# Altium project UZ_D_Voltage_3V3_5V.PrjPCB (part 1 of 2)
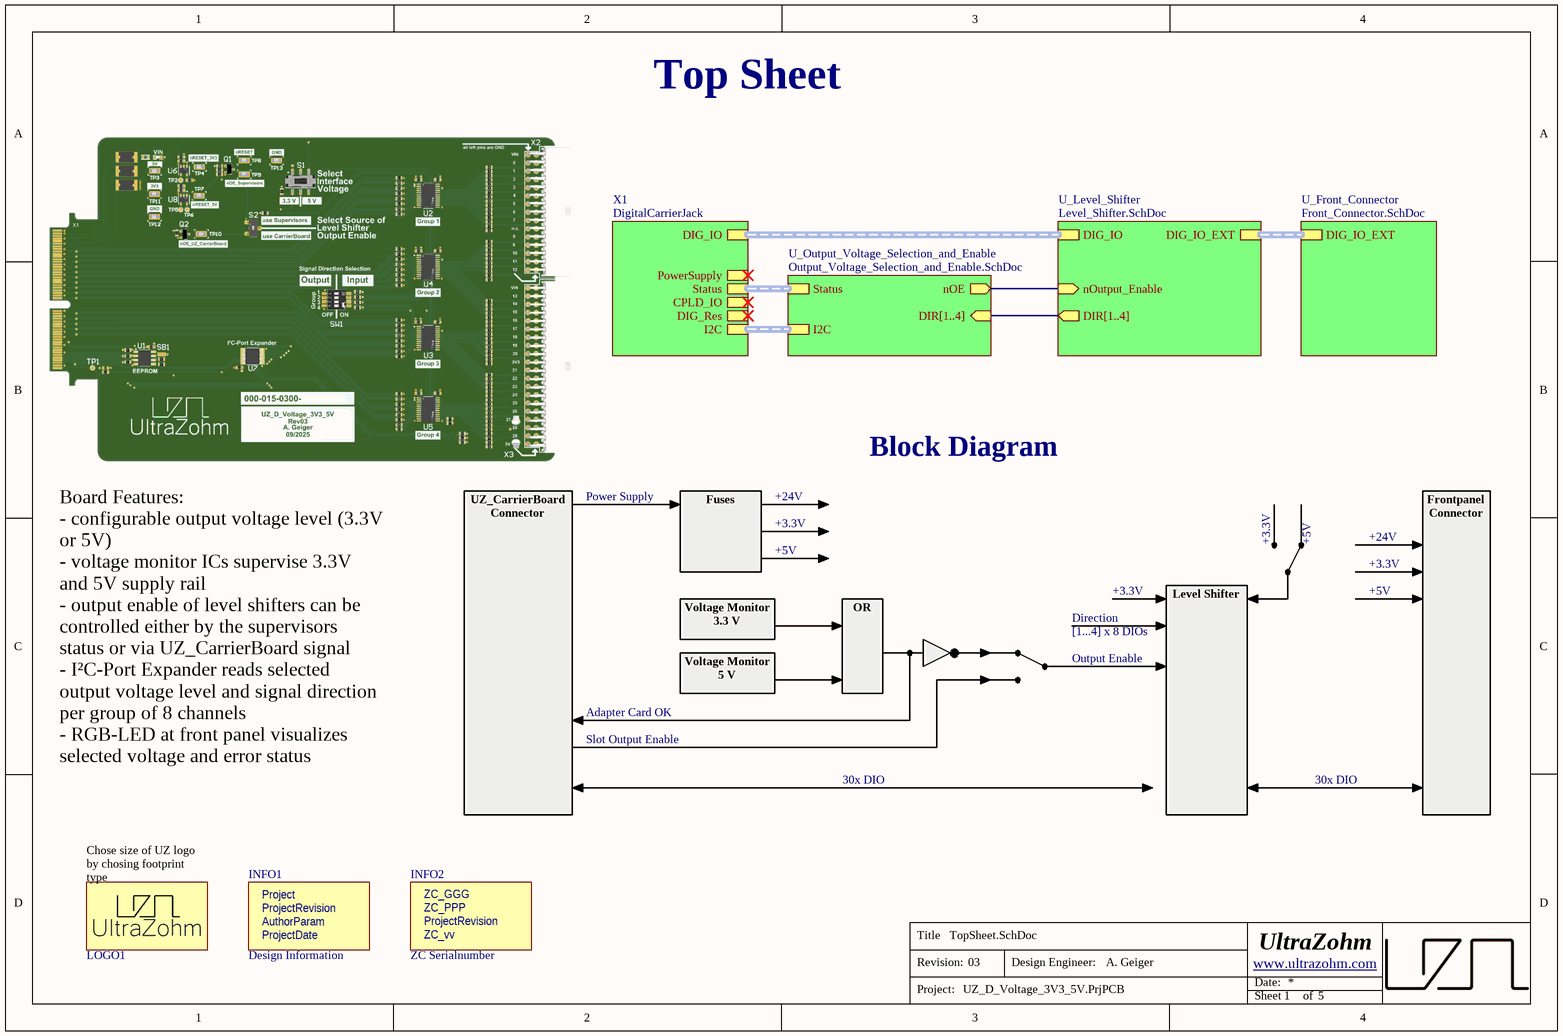
[diagram p0: TopSheet.SchDoc]
Author: A. Geiger; AuthorParam: A. Geiger; Project: UZ_D_Voltage_3V3_5V; ProjectDate: 09/2025; ProjectRevision: 03; ZC_GGG: 000; ZC_PPP: 015
5 sheets, 169 parts. Net scope: hierarchical (ports join the sheet entries above them; power ports are global).
Board file: UZ_D_Voltage_3V3_5V.PcbDoc
Sheets:
  TopSheet.SchDoc
    X1 = DigitalCarrierJack.SchDoc
    U_Front_Connector = Front_Connector.SchDoc
    U_Level_Shifter = Level_Shifter.SchDoc
    U_Output_Voltage_Selection_and_Enable = Output_Voltage_Selection_and_Enable.SchDoc

## Sheet TopSheet.SchDoc
size A4; Author: A. Geiger; CompanyName: Technische Hochschule Nürnberg Georg Simon Ohm; Organization: UltraZohm; Address1: Kesslerplatz 12; Address2: 90489 Nürnberg; Address3: GERMANY; DocumentNumber: 1; SheetNumber: 1; SheetTotal: 5; Website: www.ultrazohm.com

### Parts
INFO1  Design Information  [Design_info]  (no BOM)
INFO2  ZC Serialnumber  [ZC-Serial]  (no BOM)
LOGO1  UZ Logo  [UZ_Logo_small]  (value not drawn)  (no BOM)

### Sub-sheets
U_Front_Connector = Front_Connector.SchDoc: DIG_IO_EXT (harness DigCon_DIG_IO_EXT)
U_Level_Shifter = Level_Shifter.SchDoc: DIG_IO (harness DigCon_DIG_IO), DIG_IO_EXT (harness DigCon_DIG_IO_EXT), nOutput_Enable (in), DIR[1..4] (out)
U_Output_Voltage_Selection_and_Enable = Output_Voltage_Selection_and_Enable.SchDoc: Status (harness DigCon_Status), nOE (out), I2C (harness DigCon_I2C), DIR[1..4] (in)
X1 = DigitalCarrierJack: DIG_IO (harness DigCon_DIG_IO), PowerSupply (harness DigCon_PowerSupply), DIG_Res (harness DigCon_DIG_Res), CPLD_IO (harness DigCon_DCPLD_IO), Status (harness DigCon_Status), I2C (harness DigCon_I2C)

### Nets
nOE: sheet U_Level_Shifter/nOutput_Enable, sheet U_Output_Voltage_Selection_and_Enable/nOE

### Buses and harness runs
bus sheet U_Level_Shifter/DIR[1..4] = sheet U_Output_Voltage_Selection_and_Enable/DIR[1..4]
harness sheet U_Front_Connector/DIG_IO_EXT = sheet U_Level_Shifter/DIG_IO_EXT
harness sheet U_Level_Shifter/DIG_IO = sheet X1/DIG_IO
harness sheet U_Output_Voltage_Selection_and_Enable/I2C = sheet X1/I2C
harness sheet U_Output_Voltage_Selection_and_Enable/Status = sheet X1/Status

### Notes on the sheet
- Top Sheet
- Power Supply
- +24V
- Block Diagram
- Fuses
- +3.3V
- +5V
- Voltage Monitor
  3.3 V
- Direction
- [1...4] x 8 DIOs
- Adapter Card OK
- Voltage Monitor
  5 V
- OR
- Output Enable
- Slot Output Enable
- 30x DIO
- Board Features:
  - configurable output voltage level (3.3V or 5V)
  - voltage monitor ICs supervise 3.3V and 5V supply rail
  - output enable of level shifters can be controlled either by the supervisors status or via UZ_CarrierBoard signal
  - I²C-Port Expander reads selected output voltage level and signal direction per group of 8 channels
  - RGB-LED at front panel visualizes selected voltage and error status
- UZ_CarrierBoard
  Connector
- Level Shifter
- Frontpanel
  Connector
- (near LOGO1) Chose size of UZ logo by chosing footprint type
- Title
- Revision:
- Design Engineer:
- Date:
- Project:
- Sheet
- of
- (in symbol Design_info) Project; ProjectRevision; AuthorParam; ProjectDate
- (in symbol ZC-Serial) ZC_GGG; ZC_PPP; ProjectRevision; ZC_vv

### Library data of the parts
INFO1 = Design_info
INFO2 = ZC-Serial: Manufacturer: UltraZohm; Value: GGG-PPP-VVvv; Created from: FRosner; Manufacturer Part Number: ZC-Serial; PartID: 58; Created On: 15.04.2025 09:17:14; ComponentLink1Description: https://docs.ultrazohm.com/; ComponentLink1URL: homepage; Component Type: ZC Serialnumber; Last Updated: 15.04.2025 09:17:14; Supplier 1: -; Supplier Part Number 1: -; Type: Serial Number; Live Cycle Status: 1
LOGO1 = 1: Official Project Logo of the UltraZohm; Manufacturer: PCB Manufacturer; Manufacturer Part Number: UltraZohm Logo; Created from: T. Wendt; PartID: 1; Created On: 19.02.2021 16:55:56; ComponentLink1Description: Homepage; ComponentLink1URL: https://ultrazohm.com; Component Type: Logo; Last Updated: 02.03.2021 14:31:24; Type: Standard (No BOM); Live Cycle Status: 1

## Sheet DigitalCarrierJack.SchDoc
size A4; Author: A. Geiger; CompanyName: Technische Hochschule Nürnberg Georg Simon Ohm; Organization: UltraZohm; Address1: Kesslerplatz 12; Address2: 90489 Nürnberg; Address3: GERMANY; DocumentNumber: 2; SheetNumber: 2; SheetTotal: 5; Website: www.ultrazohm.com
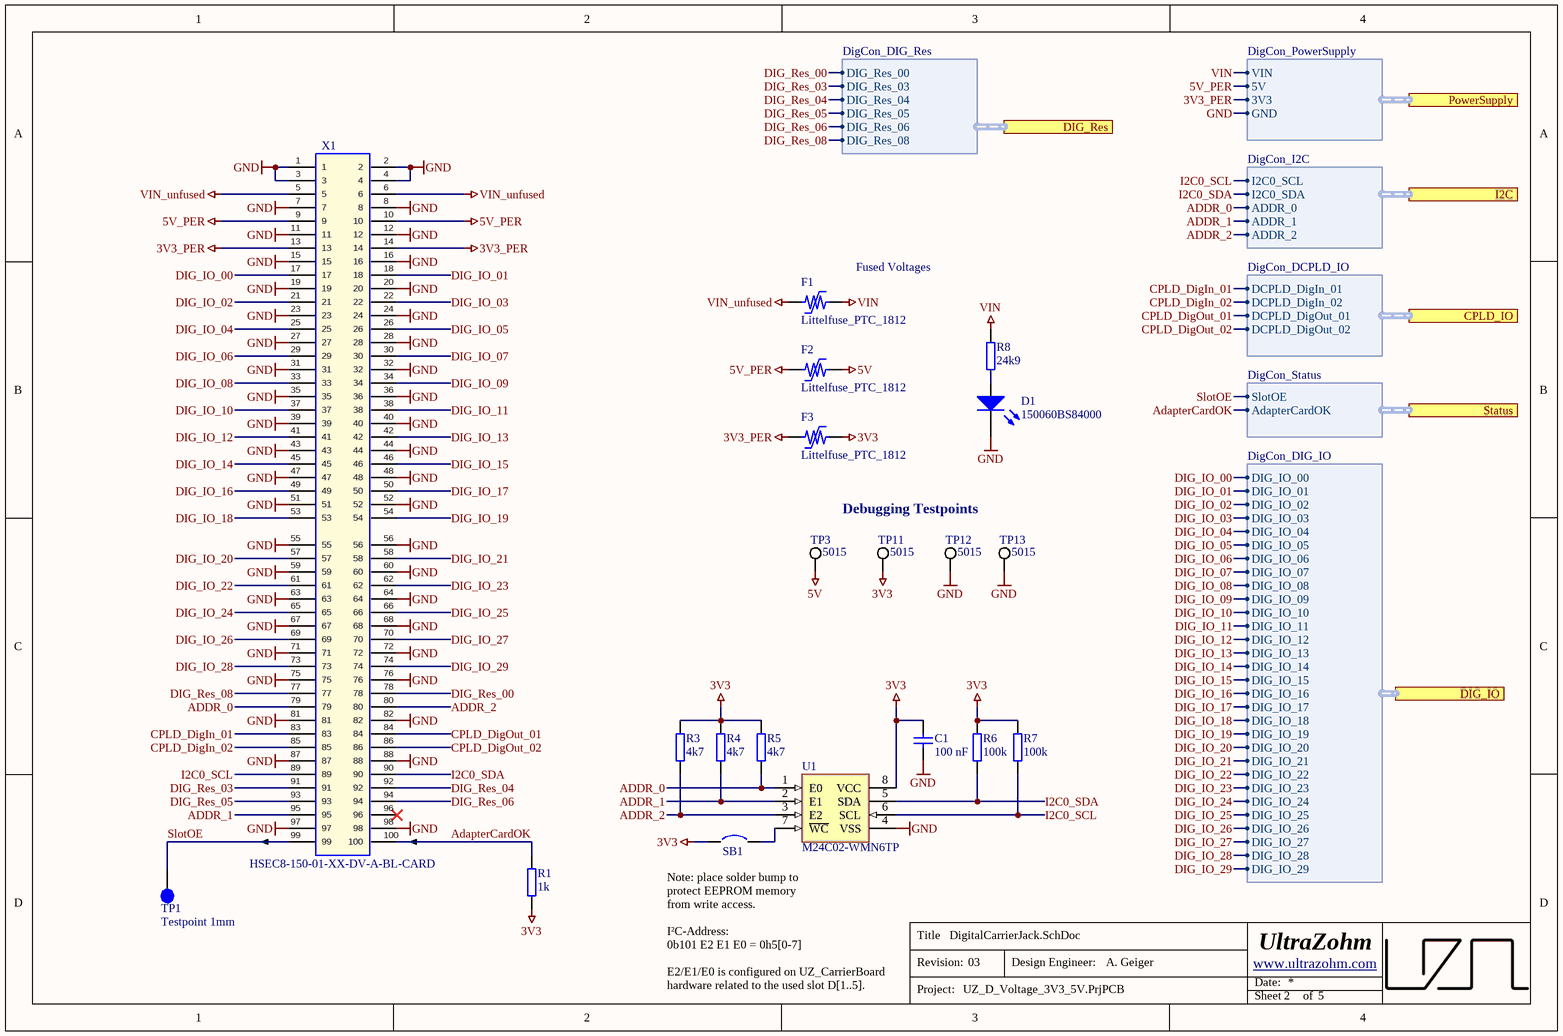
[diagram p1: DigitalCarrierJack.SchDoc]

### Parts
C1  100 nF  [C_0603_TE]
D1  150060BS84000  [WL-SMCW_0603]
F1  Littelfuse_PTC_1812  [1812_PTC_Polyfuse_Littelfuse]
F2  Littelfuse_PTC_1812  [1812_PTC_Polyfuse_Littelfuse]
F3  Littelfuse_PTC_1812  [1812_PTC_Polyfuse_Littelfuse]
R1  1k  [R_0603_TE]
R3  4k7  [R_0603_TE]
R4  4k7  [R_0603_TE]
R5  4k7  [R_0603_TE]
R6  100k  [R_0603_TE]
R7  100k  [R_0603_TE]
R8  24k9  [RES 0603_1608]
SB1  Solder Bump 0603  [SB_0603]  (value not drawn)  (no BOM)
TP1  Testpoint 1mm  [TP_1mm]  (no BOM)
TP3  5015  [FP-5015-MFG]
TP11  5015  [FP-5015-MFG]
TP12  5015  [FP-5015-MFG]
TP13  5015  [FP-5015-MFG]
U1  M24C02-WMN6TP  [D0008A_N]
X1  HSEC8-150-01-XX-DV-A-BL-CARD  [HSEC8-150-01-XX-DV-A-BL-CARD]  (no BOM)

### Ports
CPLD_IO (harness DigCon_DCPLD_IO), DIG_IO (harness DigCon_DIG_IO), DIG_Res (harness DigCon_DIG_Res), I2C (harness DigCon_I2C), PowerSupply (harness DigCon_PowerSupply), Status (harness DigCon_Status)

### Harnesses
DigCon_PowerSupply: GND, 3V3, 5V, VIN
DigCon_I2C: I2C0_SDA, I2C0_SCL, ADDR_0, ADDR_1, ADDR_2
DigCon_Status: SlotOE, AdapterCardOK
DigCon_DCPLD_IO: DCPLD_DigIn_01, DCPLD_DigIn_02, DCPLD_DigOut_01, DCPLD_DigOut_02
DigCon_DIG_IO: DIG_IO_01, DIG_IO_02, DIG_IO_03, DIG_IO_04, DIG_IO_05, DIG_IO_06, DIG_IO_07, DIG_IO_08, DIG_IO_09, DIG_IO_10, DIG_IO_11, DIG_IO_12, DIG_IO_13, DIG_IO_14, DIG_IO_15, DIG_IO_16, DIG_IO_17, DIG_IO_18, DIG_IO_19, DIG_IO_20, DIG_IO_21, DIG_IO_22, DIG_IO_23, DIG_IO_24, DIG_IO_25, DIG_IO_26, DIG_IO_27, DIG_IO_28, DIG_IO_29, DIG_IO_00
DigCon_DIG_Res: DIG_Res_03, DIG_Res_04, DIG_Res_05, DIG_Res_06, DIG_Res_00, DIG_Res_08

### Nets
3V3: C1.1 F3.2 R1.1 R3.1 R4.1 R5.1 R6.1 R7.1 SB1.1 TP11.1 U1.8(VCC)
3V3_PER: F3.1 X1.13 X1.14 ; port PowerSupply.3V3
5V: F2.2 TP3.1
5V_PER: F2.1 X1.9 X1.10 ; port PowerSupply.5V
GND: C1.2 D1.1(K) TP12.1 TP13.1 U1.4(VSS) X1.1 X1.2 X1.3 X1.4 X1.7 X1.8 X1.11 X1.12 X1.15 X1.16 X1.19 X1.20 X1.23 X1.24 X1.27 X1.28 X1.31 X1.32 X1.35 X1.36 X1.39 X1.40 X1.43 X1.44 X1.47 X1.48 X1.51 X1.52 X1.55 X1.56 X1.59 X1.60 X1.63 X1.64 X1.67 X1.68 X1.71 X1.72 X1.75 X1.76 X1.81 X1.82 X1.87 X1.88 X1.97 X1.98 ; port PowerSupply.GND
VIN: F1.2 R8.2 ; port PowerSupply.VIN
VIN_unfused: F1.1 X1.5 X1.6
AdapterCardOK: R1.2 X1.100 ; port Status.AdapterCardOK
ADDR_0: R5.2 U1.1(E0) X1.79 ; port I2C.ADDR_0
ADDR_1: R4.2 U1.2(E1) X1.95 ; port I2C.ADDR_1
ADDR_2: R3.2 U1.3(E2) X1.80 ; port I2C.ADDR_2
CPLD_DigIn_01: X1.83 ; port CPLD_IO.DCPLD_DigIn_01
CPLD_DigIn_02: X1.85 ; port CPLD_IO.DCPLD_DigIn_02
CPLD_DigOut_01: X1.84 ; port CPLD_IO.DCPLD_DigOut_01
CPLD_DigOut_02: X1.86 ; port CPLD_IO.DCPLD_DigOut_02
DIG_IO_00: X1.17 ; port DIG_IO.DIG_IO_00
DIG_IO_01: X1.18 ; port DIG_IO.DIG_IO_01
DIG_IO_02: X1.21 ; port DIG_IO.DIG_IO_02
DIG_IO_03: X1.22 ; port DIG_IO.DIG_IO_03
DIG_IO_04: X1.25 ; port DIG_IO.DIG_IO_04
DIG_IO_05: X1.26 ; port DIG_IO.DIG_IO_05
DIG_IO_06: X1.29 ; port DIG_IO.DIG_IO_06
DIG_IO_07: X1.30 ; port DIG_IO.DIG_IO_07
DIG_IO_08: X1.33 ; port DIG_IO.DIG_IO_08
DIG_IO_09: X1.34 ; port DIG_IO.DIG_IO_09
DIG_IO_10: X1.37 ; port DIG_IO.DIG_IO_10
DIG_IO_11: X1.38 ; port DIG_IO.DIG_IO_11
DIG_IO_12: X1.41 ; port DIG_IO.DIG_IO_12
DIG_IO_13: X1.42 ; port DIG_IO.DIG_IO_13
DIG_IO_14: X1.45 ; port DIG_IO.DIG_IO_14
DIG_IO_15: X1.46 ; port DIG_IO.DIG_IO_15
DIG_IO_16: X1.49 ; port DIG_IO.DIG_IO_16
DIG_IO_17: X1.50 ; port DIG_IO.DIG_IO_17
DIG_IO_18: X1.53 ; port DIG_IO.DIG_IO_18
DIG_IO_19: X1.54 ; port DIG_IO.DIG_IO_19
DIG_IO_20: X1.57 ; port DIG_IO.DIG_IO_20
DIG_IO_21: X1.58 ; port DIG_IO.DIG_IO_21
DIG_IO_22: X1.61 ; port DIG_IO.DIG_IO_22
DIG_IO_23: X1.62 ; port DIG_IO.DIG_IO_23
DIG_IO_24: X1.65 ; port DIG_IO.DIG_IO_24
DIG_IO_25: X1.66 ; port DIG_IO.DIG_IO_25
DIG_IO_26: X1.69 ; port DIG_IO.DIG_IO_26
DIG_IO_27: X1.70 ; port DIG_IO.DIG_IO_27
DIG_IO_28: X1.73 ; port DIG_IO.DIG_IO_28
DIG_IO_29: X1.74 ; port DIG_IO.DIG_IO_29
DIG_Res_00: X1.78 ; port DIG_Res.DIG_Res_00
DIG_Res_03: X1.91 ; port DIG_Res.DIG_Res_03
DIG_Res_04: X1.92 ; port DIG_Res.DIG_Res_04
DIG_Res_05: X1.93 ; port DIG_Res.DIG_Res_05
DIG_Res_06: X1.94 ; port DIG_Res.DIG_Res_06
DIG_Res_08: X1.77 ; port DIG_Res.DIG_Res_08
I2C0_SCL: R7.2 U1.6(SCL) X1.89 ; port I2C.I2C0_SCL
I2C0_SDA: R6.2 U1.5(SDA) X1.90 ; port I2C.I2C0_SDA
SlotOE: TP1.1 X1.99 ; port Status.SlotOE
NetD1_2: D1.2(A) R8.1
NetSB1_2: SB1.2 U1.7(~{WC})

Not connected (* = marked no-connect by the designer): X1 96*

### Notes on the sheet
- (near F1) Fused Voltages
- Debugging Testpoints
- Note: place solder bump to protect EEPROM memory from write access.
- I²C-Address:
  0b101 E2 E1 E0 = 0h5[0-7]
  E2/E1/E0 is configured on UZ_CarrierBoard hardware related to the used slot D[1..5].
- Title
- Revision:
- Design Engineer:
- Date:
- Project:
- Sheet
- of

### Library data of the parts
C1 = UZgen_C_0603_100nF_50V_X7R: Generic capacitor; Manufacturer: UZgen; Tolerance: 10 %; Created from: AGeiger; Voltage: 50V; Manufacturer Part Number: UZgen_C_0603_100nF_50V_X7R; PartID: 1; Created On: 02.07.2024 14:42:23; Device Package: 0603; Last Updated: 08.08.2024 15:01:15; Mounting Type: SMD; Value: 100 nF; Technology: X7R
D1 = 150060BS84000: WL-SMCW SMD Mono-color Chip LED Waterclear Blue; Manufacturer: Wuerth Elektronik; Type: Standard; Created from: MGremer; Forward Current I_f: 20 mA; Forward Voltage U_f: 3.2 V; Wavelength: 470 nm; Light Intensity: 560 mcd; Nominal Power: 78 mW; Manufacturer Part Number: 150060BS84000; PartID: 1; Created On: 08.12.2020 10:19:38; ComponentLink1Description: Datasheet; ComponentLink1URL: https://www.mouser.de/datasheet/2/445/150060BS84000-1838909.pdf; Component Type: LED Diode; Device Package: 0603; Last Updated: 21.02.2024 14:46:49; Mounting Type: SMD; Operating Temperature: -40 - 85 °C; Supplier 1: Mouser; Supplier Part Number 1: 710-150060BS84000; Supplier 2: Farnell; Supplier Part Number 2: 3408611; Supplier 3: Digi-Key; Supplier Part Number 3: 732-150060BS84000CT-ND; Live Cycle Status: 1; Stock number: not stored; Color: blue; LCSC Part Number: C5197644
F1-F3 = Littelfuse_PTC_1812: POLYSWITCH RESETTABLE DEVICES; MPN: miniASMDC110F/24; Value: PTC, 1.1 A, 24V; Voltage: 24V; Trip Current: 2.2A; Hold Current: 1.1A; Resistance: 0.18 Ohm; Type: Fuse; Nominal current: 1 A; Created from: MHlatky; MF: Littelfuse; Created: 2019_02_10_AGeiger; Package: 1812; ComponentLink1URL: https://www.littelfuse.com/~/media/electronics/datasheets/resettable_ptcs/littelfuse_ptc_surface_mount_catalog_datasheet.pdf.pdf; ComponentLink1Description: Datasheet; Manufacturer Part Number: Littelfuse_PTC_1812; PartID: 5; Created On: 07.05.2021 06:50:33; Component Type: Littelfuse_PTC_1812; Last Updated: 27.05.2022 15:06:17; Manufacturer: Littelfuse; Mounting Type: SMD; Operating Temperature: -40 - 85 °C; Supplier 1: Mouser; Supplier Part Number 1: 530-0ZCG0150BF2C; Live Cycle Status: 1; LCSC Part Number: C70119
R1 = UZgen_R_0603_1k: Generic resistor; Manufacturer: UZgen; Tolerance: 1 %; Created from: UZgenTool; Manufacturer Part Number: UZgen_R_0603_1k; PartID: 221; Created On: 02.07.2024 17:29:49; Value: 1k; Device Package: 0603; Mounting Type: SMD; Last Updated: 02.07.2024 17:29:49
R3-R5 = UZgen_R_0603_4k7: Generic resistor; Manufacturer: UZgen; Tolerance: 1 %; Created from: UZgenTool; Manufacturer Part Number: UZgen_R_0603_4k7; PartID: 237; Created On: 02.07.2024 17:29:50; Device Package: 0603; Last Updated: 02.07.2024 17:29:50; Mounting Type: SMD; Value: 4k7
R6 R7 = UZgen_R_0603_100k: Generic resistor; Manufacturer: UZgen; Tolerance: 1 %; Created from: UZgenTool; Manufacturer Part Number: UZgen_R_0603_100k; PartID: 268; Created On: 02.07.2024 17:29:50; Device Package: 0603; Last Updated: 02.07.2024 17:29:50; Mounting Type: SMD; Value: 100k
R8 = CRCW060324K9FKEA: SMD resistor 1%; Manufacturer: Vishay; Created from: MGremer; Manufacturer Part Number: CRCW060324K9FKEA; PartID: 157; Created On: 14.12.2020 16:17:14; ComponentLink1Description: Datasheet; ComponentLink1URL: https://www.mouser.de/datasheet/2/427/dcrcwe3-1762152.pdf; Component Type: SMD resistor; Device Package: 0603; Last Updated: 28.03.2025 21:19:13; Mounting Type: SMD; Supplier 1: Mouser; Supplier Part Number 1: 71-CRCW0603-24.9K-E3; Type: Resistor; Tolerance: 1%; Value: 24k9; Live Cycle Status: 1; Stock number: not stored; LCSC Part Number: C844763
SB1 = =Value: Created from: AGeiger; Revision: July-2002: Re-released for DXP Platform.; PartID: 1; Created On: 09.01.2024 17:13:56; Component Type: Solder Bump; Device Package: 0603; Last Updated: 09.01.2024 17:13:56; Manufacturer Part Number: Solder Bump 0603; Mounting Type: SMD; Value: Solder Bump 0603
TP1 = NULL: Manufacturer Part Number: NULL; Created from: AGeiger; Created: 2018_06_25_AGeiger; Value: Testpoint 1mm; PartID: 9; Created On: 20.09.2022 13:14:57; Component Type: Testpoint; Last Updated: 20.09.2022 13:15:39; Manufacturer: NULL; Supplier 1: NULL; Supplier Part Number 1: NULL; Type: Testpoint; Live Cycle Status: 1
TP3 TP11-TP13 = 5015: Circuit Board Hardware - PCB SM TEST POINT ON T&R - MINIATURE; Manufacturer: Keystone Electronics; Value: SMD Testpoint; Created from: AGeiger; ComponentLink1Description: Datasheet; ComponentLink2URL: http://www.keyelco.com/product-pdf.cfm?p=1357; ComponentLink1URL: https://www.mouser.de/datasheet/2/215/015-744075.pdf; ComponentLink2Description: Datasheet; Manufacturer Part Number: 5015; PartID: 26; Created On: 03.06.2023 11:19:55; Component Type: Circuit Board Hardware; Device Package: SMD; Last Updated: 03.06.2023 11:43:17; Mounting Type: SMD; Supplier 1: Mouser; Supplier Part Number 1: 534-5015; Type: PCB SMD Testpoint; Live Cycle Status: 1; LCSC Part Number: C5199798
U1 = M24C02-WMN6TP: 2Kbit I2C SOP-8 EEPROM ROHS; Manufacturer: STMicroelectronics; Created from: AGeiger; Manufacturer Part Number: M24C02-WMN6TP; PartID: 1; Created On: 19.11.2023 14:54:27; ComponentLink1Description: Datasheet; ComponentLink1URL: https://www.st.com/resource/en/datasheet/m24c01-w.pdf; Component Type: EEPROM; Device Package: SOIC-8; Last Updated: 19.11.2023 21:39:04; Mounting Type: SMD; Operating Temperature: -40 to +85 °C; Series: M24xxx; Supplier 1: Mouser; Supplier Part Number 1: 511-M24C02-WMN6TP; Supplier 2: LCSC; Supplier Part Number 2: C7562; Type: Memory; Value: M24C02-WMN6TP; LCSC Part Number: C7562
X1 = HSEC8-150-01-XX-DV-A-BL-CARD: Mating Card Layout for HSEC8-150-01-XX-DV-A-BL; Manufacturer: SAMTEC; Created: 2018_04_23_AGeiger; Value: HSEC8-150-01-XX-DV-A-BL-CARD

## Sheet Front_Connector.SchDoc
size A4; Author: A. Geiger; CompanyName: Technische Hochschule Nürnberg Georg Simon Ohm; Organization: UltraZohm; Address1: Kesslerplatz 12; Address2: 90489 Nürnberg; Address3: GERMANY; DocumentNumber: 3; SheetNumber: 3; SheetTotal: 5; Website: www.ultrazohm.com
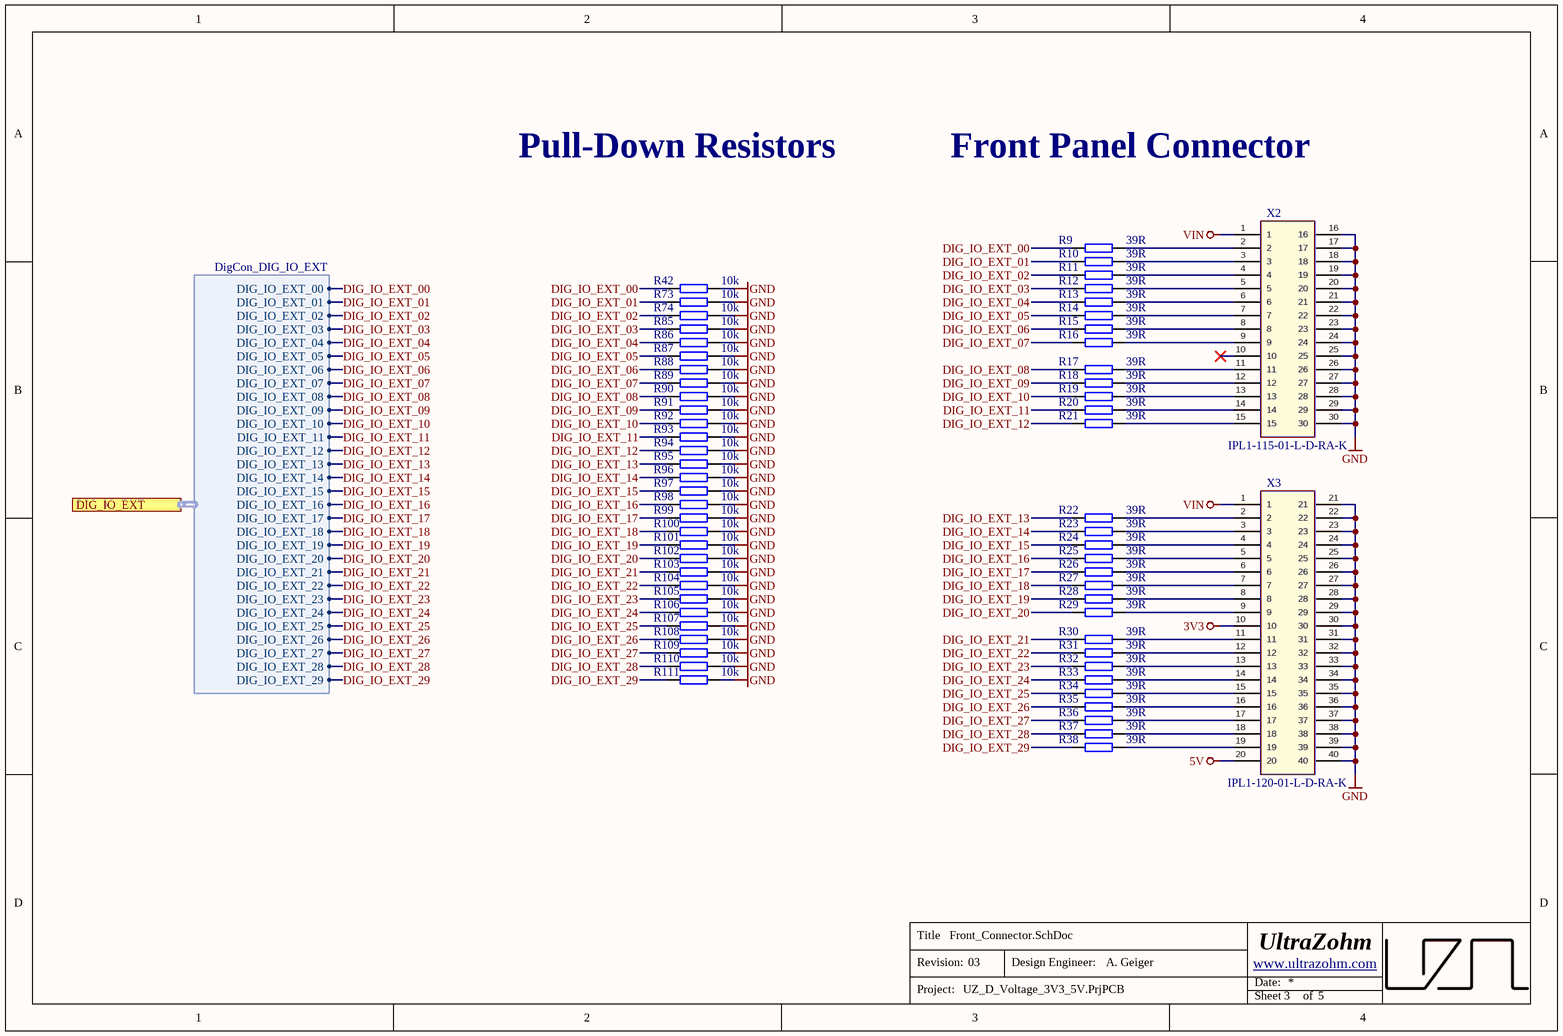
[diagram p2: Front_Connector.SchDoc]

### Parts
R9  39R  [R_0603_TE]
R10  39R  [R_0603_TE]
R11  39R  [R_0603_TE]
R12  39R  [R_0603_TE]
R13  39R  [R_0603_TE]
R14  39R  [R_0603_TE]
R15  39R  [R_0603_TE]
R16  39R  [R_0603_TE]
R17  39R  [R_0603_TE]
R18  39R  [R_0603_TE]
R19  39R  [R_0603_TE]
R20  39R  [R_0603_TE]
R21  39R  [R_0603_TE]
R22  39R  [R_0603_TE]
R23  39R  [R_0603_TE]
R24  39R  [R_0603_TE]
R25  39R  [R_0603_TE]
R26  39R  [R_0603_TE]
R27  39R  [R_0603_TE]
R28  39R  [R_0603_TE]
R29  39R  [R_0603_TE]
R30  39R  [R_0603_TE]
R31  39R  [R_0603_TE]
R32  39R  [R_0603_TE]
R33  39R  [R_0603_TE]
R34  39R  [R_0603_TE]
R35  39R  [R_0603_TE]
R36  39R  [R_0603_TE]
R37  39R  [R_0603_TE]
R38  39R  [R_0603_TE]
R42  10k  [R_0603_TE]
R73  10k  [R_0603_TE]
R74  10k  [R_0603_TE]
R85  10k  [R_0603_TE]
R86  10k  [R_0603_TE]
R87  10k  [R_0603_TE]
R88  10k  [R_0603_TE]
R89  10k  [R_0603_TE]
R90  10k  [R_0603_TE]
R91  10k  [R_0603_TE]
R92  10k  [R_0603_TE]
R93  10k  [R_0603_TE]
R94  10k  [R_0603_TE]
R95  10k  [R_0603_TE]
R96  10k  [R_0603_TE]
R97  10k  [R_0603_TE]
R98  10k  [R_0603_TE]
R99  10k  [R_0603_TE]
R100  10k  [R_0603_TE]
R101  10k  [R_0603_TE]
R102  10k  [R_0603_TE]
R103  10k  [R_0603_TE]
R104  10k  [R_0603_TE]
R105  10k  [R_0603_TE]
R106  10k  [R_0603_TE]
R107  10k  [R_0603_TE]
R108  10k  [R_0603_TE]
R109  10k  [R_0603_TE]
R110  10k  [R_0603_TE]
R111  10k  [R_0603_TE]
X2  IPL1-115-01-L-D-RA-K  [IPL1-115-01-XX-D-RA]
X3  IPL1-120-01-L-D-RA-K  [IPL1-120-01-XX-D-RA]

### Ports
DIG_IO_EXT (harness DigCon_DIG_IO_EXT)

### Harnesses
DigCon_DIG_IO_EXT: DIG_IO_EXT_00, DIG_IO_EXT_01, DIG_IO_EXT_02, DIG_IO_EXT_03, DIG_IO_EXT_04, DIG_IO_EXT_05, DIG_IO_EXT_06, DIG_IO_EXT_07, DIG_IO_EXT_08, DIG_IO_EXT_09, DIG_IO_EXT_10, DIG_IO_EXT_11, DIG_IO_EXT_12, DIG_IO_EXT_13, DIG_IO_EXT_14, DIG_IO_EXT_15, DIG_IO_EXT_16, DIG_IO_EXT_17, DIG_IO_EXT_18, DIG_IO_EXT_19, DIG_IO_EXT_20, DIG_IO_EXT_21, DIG_IO_EXT_22, DIG_IO_EXT_23, DIG_IO_EXT_24, DIG_IO_EXT_25, DIG_IO_EXT_26, DIG_IO_EXT_27, DIG_IO_EXT_28, DIG_IO_EXT_29

### Nets
3V3: X3.10
5V: X3.20
GND: R42.2 R73.2 R74.2 R85.2 R86.2 R87.2 R88.2 R89.2 R90.2 R91.2 R92.2 R93.2 R94.2 R95.2 R96.2 R97.2 R98.2 R99.2 R100.2 R101.2 R102.2 R103.2 R104.2 R105.2 R106.2 R107.2 R108.2 R109.2 R110.2 R111.2 X2.16 X2.17 X2.18 X2.19 X2.20 X2.21 X2.22 X2.23 X2.24 X2.25 X2.26 X2.27 X2.28 X2.29 X2.30 X3.21 X3.22 X3.23 X3.24 X3.25 X3.26 X3.27 X3.28 X3.29 X3.30 X3.31 X3.32 X3.33 X3.34 X3.35 X3.36 X3.37 X3.38 X3.39 X3.40
VIN: X2.1 X3.1
DIG_IO_EXT_00: R9.1 R42.1 ; port DIG_IO_EXT.DIG_IO_EXT_00
DIG_IO_EXT_01: R10.1 R73.1 ; port DIG_IO_EXT.DIG_IO_EXT_01
DIG_IO_EXT_02: R11.1 R74.1 ; port DIG_IO_EXT.DIG_IO_EXT_02
DIG_IO_EXT_03: R12.1 R85.1 ; port DIG_IO_EXT.DIG_IO_EXT_03
DIG_IO_EXT_04: R13.1 R86.1 ; port DIG_IO_EXT.DIG_IO_EXT_04
DIG_IO_EXT_05: R14.1 R87.1 ; port DIG_IO_EXT.DIG_IO_EXT_05
DIG_IO_EXT_06: R15.1 R88.1 ; port DIG_IO_EXT.DIG_IO_EXT_06
DIG_IO_EXT_07: R16.1 R89.1 ; port DIG_IO_EXT.DIG_IO_EXT_07
DIG_IO_EXT_08: R17.1 R90.1 ; port DIG_IO_EXT.DIG_IO_EXT_08
DIG_IO_EXT_09: R18.1 R91.1 ; port DIG_IO_EXT.DIG_IO_EXT_09
DIG_IO_EXT_10: R19.1 R92.1 ; port DIG_IO_EXT.DIG_IO_EXT_10
DIG_IO_EXT_11: R20.1 R93.1 ; port DIG_IO_EXT.DIG_IO_EXT_11
DIG_IO_EXT_12: R21.1 R94.1 ; port DIG_IO_EXT.DIG_IO_EXT_12
DIG_IO_EXT_13: R22.1 R95.1 ; port DIG_IO_EXT.DIG_IO_EXT_13
DIG_IO_EXT_14: R23.1 R96.1 ; port DIG_IO_EXT.DIG_IO_EXT_14
DIG_IO_EXT_15: R24.1 R97.1 ; port DIG_IO_EXT.DIG_IO_EXT_15
DIG_IO_EXT_16: R25.1 R98.1 ; port DIG_IO_EXT.DIG_IO_EXT_16
DIG_IO_EXT_17: R26.1 R99.1 ; port DIG_IO_EXT.DIG_IO_EXT_17
DIG_IO_EXT_18: R27.1 R100.1 ; port DIG_IO_EXT.DIG_IO_EXT_18
DIG_IO_EXT_19: R28.1 R101.1 ; port DIG_IO_EXT.DIG_IO_EXT_19
DIG_IO_EXT_20: R29.1 R102.1 ; port DIG_IO_EXT.DIG_IO_EXT_20
DIG_IO_EXT_21: R30.1 R103.1 ; port DIG_IO_EXT.DIG_IO_EXT_21
DIG_IO_EXT_22: R31.1 R104.1 ; port DIG_IO_EXT.DIG_IO_EXT_22
DIG_IO_EXT_23: R32.1 R105.1 ; port DIG_IO_EXT.DIG_IO_EXT_23
DIG_IO_EXT_24: R33.1 R106.1 ; port DIG_IO_EXT.DIG_IO_EXT_24
DIG_IO_EXT_25: R34.1 R107.1 ; port DIG_IO_EXT.DIG_IO_EXT_25
DIG_IO_EXT_26: R35.1 R108.1 ; port DIG_IO_EXT.DIG_IO_EXT_26
DIG_IO_EXT_27: R36.1 R109.1 ; port DIG_IO_EXT.DIG_IO_EXT_27
DIG_IO_EXT_28: R37.1 R110.1 ; port DIG_IO_EXT.DIG_IO_EXT_28
DIG_IO_EXT_29: R38.1 R111.1 ; port DIG_IO_EXT.DIG_IO_EXT_29
NetR9_2: R9.2 X2.2
NetR10_2: R10.2 X2.3
NetR11_2: R11.2 X2.4
NetR12_2: R12.2 X2.5
NetR13_2: R13.2 X2.6
NetR14_2: R14.2 X2.7
NetR15_2: R15.2 X2.8
NetR16_2: R16.2 X2.9
NetR17_2: R17.2 X2.11
NetR18_2: R18.2 X2.12
NetR19_2: R19.2 X2.13
NetR20_2: R20.2 X2.14
NetR21_2: R21.2 X2.15
NetR22_2: R22.2 X3.2
NetR23_2: R23.2 X3.3
NetR24_2: R24.2 X3.4
NetR25_2: R25.2 X3.5
NetR26_2: R26.2 X3.6
NetR27_2: R27.2 X3.7
NetR28_2: R28.2 X3.8
NetR29_2: R29.2 X3.9
NetR30_2: R30.2 X3.11
NetR31_2: R31.2 X3.12
NetR32_2: R32.2 X3.13
NetR33_2: R33.2 X3.14
NetR34_2: R34.2 X3.15
NetR35_2: R35.2 X3.16
NetR36_2: R36.2 X3.17
NetR37_2: R37.2 X3.18
NetR38_2: R38.2 X3.19

Not connected (* = marked no-connect by the designer): X2 10*

### Notes on the sheet
- Pull-Down Resistors
- Front Panel Connector
- Title
- Revision:
- Design Engineer:
- Date:
- Project:
- Sheet
- of

### Library data of the parts
R9-R38 = UZgen_R_0603_39R: Generic resistor; Manufacturer: UZgen; Tolerance: 1 %; Created from: UZgenTool; Manufacturer Part Number: UZgen_R_0603_39R; PartID: 187; Created On: 02.07.2024 17:29:48; Device Package: 0603; Last Updated: 02.07.2024 17:29:48; Mounting Type: SMD; Value: 39R
R42 R73 R74 R85-R111 = UZgen_R_0603_10k: Generic resistor; Manufacturer: UZgen; Tolerance: 1 %; Created from: AGeiger; Manufacturer Part Number: UZgen_R_0603_10k; PartID: 1; Created On: 02.07.2024 14:34:53; Value: 10k; Device Package: 0603; Mounting Type: SMD; Last Updated: 02.07.2024 14:37:16
X2 = IPL1-115-01-L-D-RA-K: Terminal Assembly, Double Row, Right Angle, Thru-Hole, 2.54 mm x 2.54 mm Pitch, 30 Pins; Manufacturer: SAMTEC; Created from: TWendt; Number of positions: 30; Manufacturer Part Number: IPL1-115-01-L-D-RA-K; PartID: 34; Created On: 12.02.2021 15:31:18; ComponentLink1Description: Homepage; ComponentLink1URL: https://www.samtec.com/products/ipl1; Component Type: Samtec Connector; Device Package: Connector; Last Updated: 15.02.2021 10:07:42; Supplier 1: SAMTEC; Supplier Part Number 1: IPL1-115-01-L-D-RA-K; Type: Connector; Live Cycle Status: 1; Number of rows: 2; Stock number: not stored
X3 = IPL1-120-01-L-D-RA-K: Terminal Assembly, Double Row, Right Angle, Thru-Hole, 2.54 mm x 2.54 mm Pitch, 40 Pins; Manufacturer: SAMTEC; Created from: TWendt; Number of positions: 40; Manufacturer Part Number: IPL1-120-01-L-D-RA-K; PartID: 33; Created On: 12.02.2021 15:26:11; ComponentLink1Description: Homepage; ComponentLink1URL: https://www.samtec.com/products/ipl1; Component Type: Samtec Connector; Device Package: Connector; Last Updated: 15.02.2021 10:07:42; Mounting Type: THT; Supplier 1: SAMTEC; Supplier Part Number 1: IPL1-120-01-L-D-RA-K; Type: Connector; Live Cycle Status: 1; Number of rows: 2; Stock number: not stored

## Sheet Level_Shifter.SchDoc
size A4; Author: A. Geiger; CompanyName: Technische Hochschule Nürnberg Georg Simon Ohm; Organization: UltraZohm; Address1: Kesslerplatz 12; Address2: 90489 Nürnberg; Address3: GERMANY; DocumentNumber: 4; SheetNumber: 4; SheetTotal: 5; Website: www.ultrazohm.com
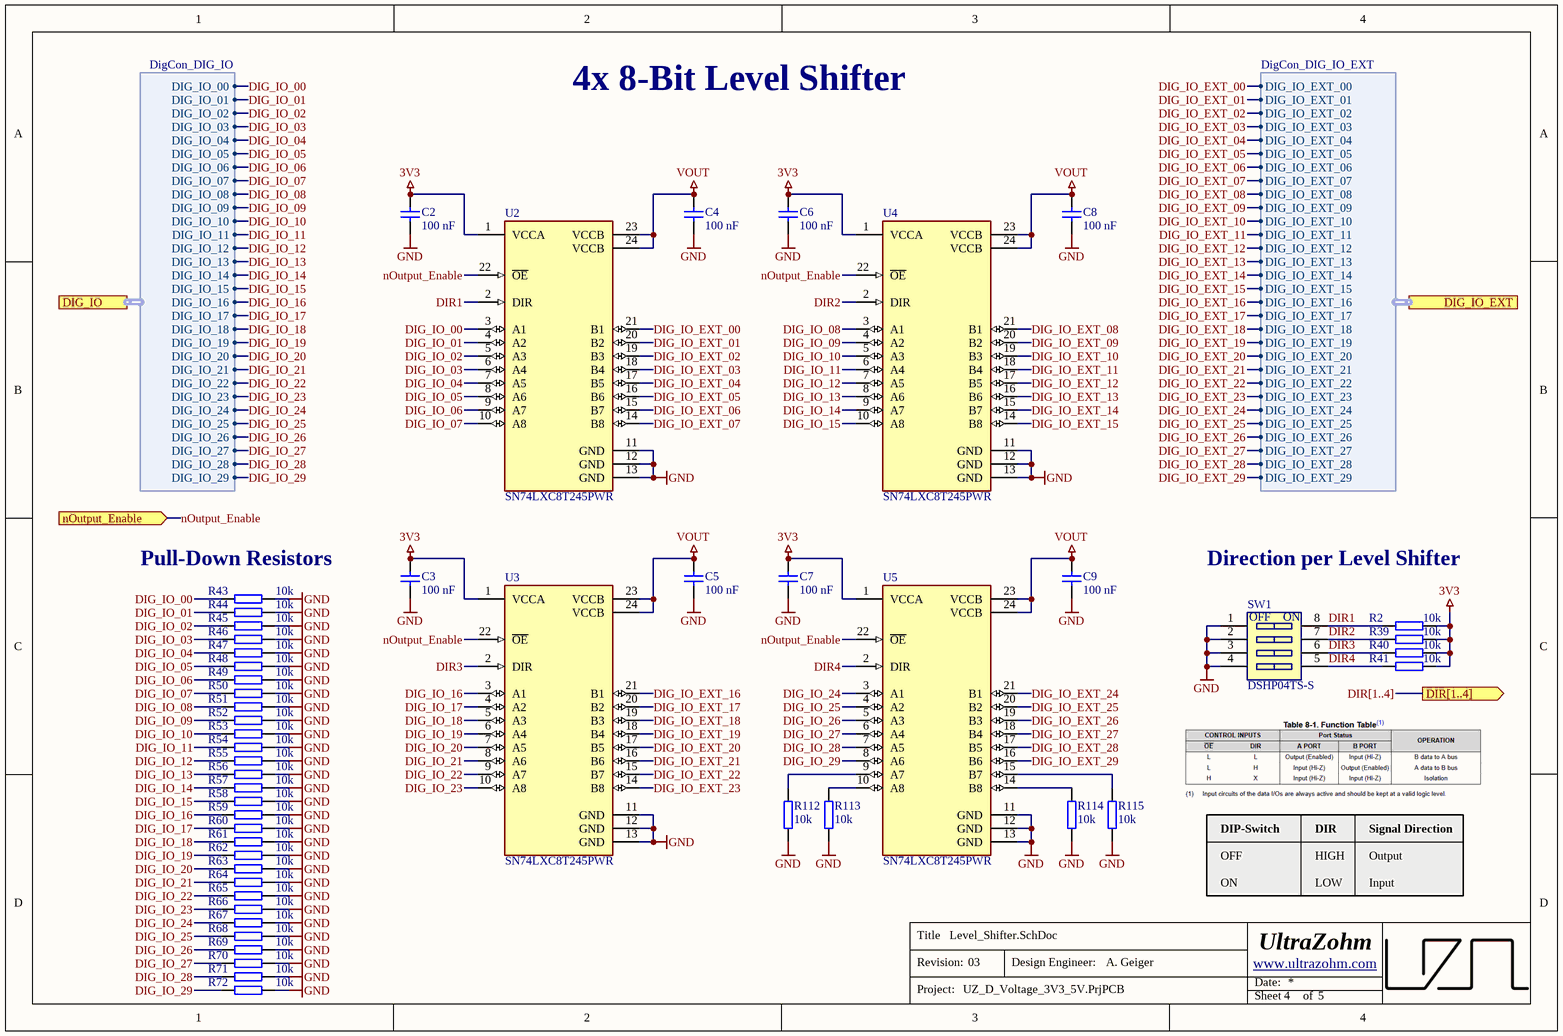
[diagram p3: Level_Shifter.SchDoc]

### Parts
C2  100 nF  [C_0603_TE]
C3  100 nF  [C_0603_TE]
C4  100 nF  [C_0603_TE]
C5  100 nF  [C_0603_TE]
C6  100 nF  [C_0603_TE]
C7  100 nF  [C_0603_TE]
C8  100 nF  [C_0603_TE]
C9  100 nF  [C_0603_TE]
R2  10k  [R_0603_TE]
R39  10k  [R_0603_TE]
R40  10k  [R_0603_TE]
R41  10k  [R_0603_TE]
R43  10k  [R_0603_TE]
R44  10k  [R_0603_TE]
R45  10k  [R_0603_TE]
R46  10k  [R_0603_TE]
R47  10k  [R_0603_TE]
R48  10k  [R_0603_TE]
R49  10k  [R_0603_TE]
R50  10k  [R_0603_TE]
R51  10k  [R_0603_TE]
R52  10k  [R_0603_TE]
R53  10k  [R_0603_TE]
R54  10k  [R_0603_TE]
R55  10k  [R_0603_TE]
R56  10k  [R_0603_TE]
R57  10k  [R_0603_TE]
R58  10k  [R_0603_TE]
R59  10k  [R_0603_TE]
R60  10k  [R_0603_TE]
R61  10k  [R_0603_TE]
R62  10k  [R_0603_TE]
R63  10k  [R_0603_TE]
R64  10k  [R_0603_TE]
R65  10k  [R_0603_TE]
R66  10k  [R_0603_TE]
R67  10k  [R_0603_TE]
R68  10k  [R_0603_TE]
R69  10k  [R_0603_TE]
R70  10k  [R_0603_TE]
R71  10k  [R_0603_TE]
R72  10k  [R_0603_TE]
R112  10k  [R_0603_TE]
R113  10k  [R_0603_TE]
R114  10k  [R_0603_TE]
R115  10k  [R_0603_TE]
SW1  DSHP04TS-S  [416131160804]
U2  SN74LXC8T245PWR  [TSSOP-24]
U3  SN74LXC8T245PWR  [TSSOP-24]
U4  SN74LXC8T245PWR  [TSSOP-24]
U5  SN74LXC8T245PWR  [TSSOP-24]

### Ports
DIG_IO (harness DigCon_DIG_IO), DIG_IO_EXT (harness DigCon_DIG_IO_EXT), DIR[1..4] (out), nOutput_Enable (in)

### Harnesses
DigCon_DIG_IO: DIG_IO_01, DIG_IO_02, DIG_IO_03, DIG_IO_04, DIG_IO_05, DIG_IO_06, DIG_IO_07, DIG_IO_08, DIG_IO_09, DIG_IO_10, DIG_IO_11, DIG_IO_12, DIG_IO_13, DIG_IO_14, DIG_IO_15, DIG_IO_16, DIG_IO_17, DIG_IO_18, DIG_IO_19, DIG_IO_20, DIG_IO_21, DIG_IO_22, DIG_IO_23, DIG_IO_24, DIG_IO_25, DIG_IO_26, DIG_IO_27, DIG_IO_28, DIG_IO_29, DIG_IO_00
DigCon_DIG_IO_EXT: DIG_IO_EXT_00, DIG_IO_EXT_01, DIG_IO_EXT_02, DIG_IO_EXT_03, DIG_IO_EXT_04, DIG_IO_EXT_05, DIG_IO_EXT_06, DIG_IO_EXT_07, DIG_IO_EXT_08, DIG_IO_EXT_09, DIG_IO_EXT_10, DIG_IO_EXT_11, DIG_IO_EXT_12, DIG_IO_EXT_13, DIG_IO_EXT_14, DIG_IO_EXT_15, DIG_IO_EXT_16, DIG_IO_EXT_17, DIG_IO_EXT_18, DIG_IO_EXT_19, DIG_IO_EXT_20, DIG_IO_EXT_21, DIG_IO_EXT_22, DIG_IO_EXT_23, DIG_IO_EXT_24, DIG_IO_EXT_25, DIG_IO_EXT_26, DIG_IO_EXT_27, DIG_IO_EXT_28, DIG_IO_EXT_29

### Nets
3V3: C2.1 C3.1 C6.1 C7.1 R2.2 R39.2 R40.2 R41.2 U2.1(VCCA) U3.1(VCCA) U4.1(VCCA) U5.1(VCCA)
GND: C2.2 C3.2 C4.2 C5.2 C6.2 C7.2 C8.2 C9.2 R43.2 R44.2 R45.2 R46.2 R47.2 R48.2 R49.2 R50.2 R51.2 R52.2 R53.2 R54.2 R55.2 R56.2 R57.2 R58.2 R59.2 R60.2 R61.2 R62.2 R63.2 R64.2 R65.2 R66.2 R67.2 R68.2 R69.2 R70.2 R71.2 R72.2 R112.1 R113.1 R114.1 R115.1 SW1.1 SW1.2 SW1.3 SW1.4 U2.11(GND) U2.12(GND) U2.13(GND) U3.11(GND) U3.12(GND) U3.13(GND) U4.11(GND) U4.12(GND) U4.13(GND) U5.11(GND) U5.12(GND) U5.13(GND)
VOUT: C4.1 C5.1 C8.1 C9.1 U2.23(VCCB) U2.24(VCCB) U3.23(VCCB) U3.24(VCCB) U4.23(VCCB) U4.24(VCCB) U5.23(VCCB) U5.24(VCCB)
DIG_IO_00: R43.1 U2.3(A1) ; port DIG_IO.DIG_IO_00
DIG_IO_01: R44.1 U2.4(A2) ; port DIG_IO.DIG_IO_01
DIG_IO_02: R45.1 U2.5(A3) ; port DIG_IO.DIG_IO_02
DIG_IO_03: R46.1 U2.6(A4) ; port DIG_IO.DIG_IO_03
DIG_IO_04: R47.1 U2.7(A5) ; port DIG_IO.DIG_IO_04
DIG_IO_05: R48.1 U2.8(A6) ; port DIG_IO.DIG_IO_05
DIG_IO_06: R49.1 U2.9(A7) ; port DIG_IO.DIG_IO_06
DIG_IO_07: R50.1 U2.10(A8) ; port DIG_IO.DIG_IO_07
DIG_IO_08: R51.1 U4.3(A1) ; port DIG_IO.DIG_IO_08
DIG_IO_09: R52.1 U4.4(A2) ; port DIG_IO.DIG_IO_09
DIG_IO_10: R53.1 U4.5(A3) ; port DIG_IO.DIG_IO_10
DIG_IO_11: R54.1 U4.6(A4) ; port DIG_IO.DIG_IO_11
DIG_IO_12: R55.1 U4.7(A5) ; port DIG_IO.DIG_IO_12
DIG_IO_13: R56.1 U4.8(A6) ; port DIG_IO.DIG_IO_13
DIG_IO_14: R57.1 U4.9(A7) ; port DIG_IO.DIG_IO_14
DIG_IO_15: R58.1 U4.10(A8) ; port DIG_IO.DIG_IO_15
DIG_IO_16: R59.1 U3.3(A1) ; port DIG_IO.DIG_IO_16
DIG_IO_17: R60.1 U3.4(A2) ; port DIG_IO.DIG_IO_17
DIG_IO_18: R61.1 U3.5(A3) ; port DIG_IO.DIG_IO_18
DIG_IO_19: R62.1 U3.6(A4) ; port DIG_IO.DIG_IO_19
DIG_IO_20: R63.1 U3.7(A5) ; port DIG_IO.DIG_IO_20
DIG_IO_21: R64.1 U3.8(A6) ; port DIG_IO.DIG_IO_21
DIG_IO_22: R65.1 U3.9(A7) ; port DIG_IO.DIG_IO_22
DIG_IO_23: R66.1 U3.10(A8) ; port DIG_IO.DIG_IO_23
DIG_IO_24: R67.1 U5.3(A1) ; port DIG_IO.DIG_IO_24
DIG_IO_25: R68.1 U5.4(A2) ; port DIG_IO.DIG_IO_25
DIG_IO_26: R69.1 U5.5(A3) ; port DIG_IO.DIG_IO_26
DIG_IO_27: R70.1 U5.6(A4) ; port DIG_IO.DIG_IO_27
DIG_IO_28: R71.1 U5.7(A5) ; port DIG_IO.DIG_IO_28
DIG_IO_29: R72.1 U5.8(A6) ; port DIG_IO.DIG_IO_29
DIG_IO_EXT_00: U2.21(B1) ; port DIG_IO_EXT.DIG_IO_EXT_00
DIG_IO_EXT_01: U2.20(B2) ; port DIG_IO_EXT.DIG_IO_EXT_01
DIG_IO_EXT_02: U2.19(B3) ; port DIG_IO_EXT.DIG_IO_EXT_02
DIG_IO_EXT_03: U2.18(B4) ; port DIG_IO_EXT.DIG_IO_EXT_03
DIG_IO_EXT_04: U2.17(B5) ; port DIG_IO_EXT.DIG_IO_EXT_04
DIG_IO_EXT_05: U2.16(B6) ; port DIG_IO_EXT.DIG_IO_EXT_05
DIG_IO_EXT_06: U2.15(B7) ; port DIG_IO_EXT.DIG_IO_EXT_06
DIG_IO_EXT_07: U2.14(B8) ; port DIG_IO_EXT.DIG_IO_EXT_07
DIG_IO_EXT_08: U4.21(B1) ; port DIG_IO_EXT.DIG_IO_EXT_08
DIG_IO_EXT_09: U4.20(B2) ; port DIG_IO_EXT.DIG_IO_EXT_09
DIG_IO_EXT_10: U4.19(B3) ; port DIG_IO_EXT.DIG_IO_EXT_10
DIG_IO_EXT_11: U4.18(B4) ; port DIG_IO_EXT.DIG_IO_EXT_11
DIG_IO_EXT_12: U4.17(B5) ; port DIG_IO_EXT.DIG_IO_EXT_12
DIG_IO_EXT_13: U4.16(B6) ; port DIG_IO_EXT.DIG_IO_EXT_13
DIG_IO_EXT_14: U4.15(B7) ; port DIG_IO_EXT.DIG_IO_EXT_14
DIG_IO_EXT_15: U4.14(B8) ; port DIG_IO_EXT.DIG_IO_EXT_15
DIG_IO_EXT_16: U3.21(B1) ; port DIG_IO_EXT.DIG_IO_EXT_16
DIG_IO_EXT_17: U3.20(B2) ; port DIG_IO_EXT.DIG_IO_EXT_17
DIG_IO_EXT_18: U3.19(B3) ; port DIG_IO_EXT.DIG_IO_EXT_18
DIG_IO_EXT_19: U3.18(B4) ; port DIG_IO_EXT.DIG_IO_EXT_19
DIG_IO_EXT_20: U3.17(B5) ; port DIG_IO_EXT.DIG_IO_EXT_20
DIG_IO_EXT_21: U3.16(B6) ; port DIG_IO_EXT.DIG_IO_EXT_21
DIG_IO_EXT_22: U3.15(B7) ; port DIG_IO_EXT.DIG_IO_EXT_22
DIG_IO_EXT_23: U3.14(B8) ; port DIG_IO_EXT.DIG_IO_EXT_23
DIG_IO_EXT_24: U5.21(B1) ; port DIG_IO_EXT.DIG_IO_EXT_24
DIG_IO_EXT_25: U5.20(B2) ; port DIG_IO_EXT.DIG_IO_EXT_25
DIG_IO_EXT_26: U5.19(B3) ; port DIG_IO_EXT.DIG_IO_EXT_26
DIG_IO_EXT_27: U5.18(B4) ; port DIG_IO_EXT.DIG_IO_EXT_27
DIG_IO_EXT_28: U5.17(B5) ; port DIG_IO_EXT.DIG_IO_EXT_28
DIG_IO_EXT_29: U5.16(B6) ; port DIG_IO_EXT.DIG_IO_EXT_29
DIR1: R2.1 SW1.8 U2.2(DIR)
DIR2: R39.1 SW1.7 U4.2(DIR)
DIR3: R40.1 SW1.6 U3.2(DIR)
DIR4: R41.1 SW1.5 U5.2(DIR)
nOutput_Enable: U2.22(~{OE}) U3.22(~{OE}) U4.22(~{OE}) U5.22(~{OE}) ; port nOutput_Enable  [project net nOE]
NetR112_2: R112.2 U5.9(A7)
NetR113_2: R113.2 U5.10(A8)
NetR114_2: R114.2 U5.14(B8)
NetR115_2: R115.2 U5.15(B7)

### Buses and harness runs
bus DIR[1..4] = port DIR[1..4]

### Notes on the sheet
- 4x 8-Bit Level Shifter
- Pull-Down Resistors
- Direction per Level Shifter
- DIP-Switch
- OFF
- DIR
- HIGH
- Signal Direction
- Output
- ON
- LOW
- Input
- Title
- Revision:
- Design Engineer:
- Date:
- Project:
- Sheet
- of
- (in symbol DSHP04TS-S) OFF; ON

### Library data of the parts
C2-C9 = UZgen_C_0603_100nF_50V_X7R: Generic capacitor; Manufacturer: UZgen; Voltage: 50V; Tolerance: 10 %; Created from: AGeiger; Manufacturer Part Number: UZgen_C_0603_100nF_50V_X7R; PartID: 1; Created On: 02.07.2024 14:42:23; Value: 100 nF; Device Package: 0603; Technology: X7R; Mounting Type: SMD; Last Updated: 08.08.2024 15:01:15
R2 R39-R41 R43-R72 R112-R115 = UZgen_R_0603_10k: as R42 on sheet Front_Connector; Manufacturer Part Number: UZgen_R_0603_10k; PartID: 1; Created On: 02.07.2024 14:34:53; Value: 10k; Device Package: 0603; Mounting Type: SMD; Last Updated: 02.07.2024 14:37:16
SW1 = DSHP04TS-S: 04p, 1.27mm Pitch, Horizontal, HP Type, SMT, flat Actuator, black, with Tape, T&R; Manufacturer: XKB Connectivity; Value: DIP-Switch; Created from: T. Wendt; Manufacturer Part Number: DSHP04TS-S; PartID: 6; Created On: 02.03.2021 14:59:37; ComponentLink1Description: Datasheet; ComponentLink1URL: https://www.lcsc.com/datasheet/lcsc_datasheet_2110151630_XKB-Connection-DSHP04TS-S_C319050.pdf; Component Type: DIP-Switch; Device Package: DIP; Last Updated: 20.12.2024 15:31:19; Minimum Order: 1; Mounting Type: SMD; Supplier 1: LCSC; Supplier Part Number 1: C319050; Type: DIP-Switch; Live Cycle Status: 1; LCSC Part Number: C319050; Stock number: not stored
U2-U5 = SN74LXC8T245PWR: 8-bit Dual-Supply Bus Transceiver with Configurable Level Shifting and 3-State Outputs; Manufacturer: Texas Instruments; Value: 1.1 - 5.5 V; Created from: AGeiger; ComponentLink2Description: Datasheet; ComponentLink2URL: http://www.ti.com/lit/ds/symlink/sn74lvc8t245.pdf; Manufacturer Part Number: SN74LXC8T245PWR; PartID: 12; Created On: 13.12.2024 11:01:59; ComponentLink1Description: Datasheet; ComponentLink1URL: https://www.ti.com/lit/ds/symlink/sn74lxc8t245.pdf; Component Type: Level Shifter; Device Package: TSSOP-24; Last Updated: 20.12.2024 10:32:15; Mounting Type: SMD; Operating Temperature: –40 to +125 °C; Series: SN74LXC8T245; Supplier 1: Mouser; Supplier Part Number 1: 595-SN74LXC8T245PWR; Supplier 2: LCSC; Supplier Part Number 2: C4363995; Type: Level Shifter; Live Cycle Status: 1; Stock number: not stored; LCSC Part Number: C4363995

## Sheet Output_Voltage_Selection_and_Enable.SchDoc
size A4; Author: A. Geiger; CompanyName: Technische Hochschule Nürnberg Georg Simon Ohm; Organization: UltraZohm; Address1: Kesslerplatz 12; Address2: 90489 Nürnberg; Address3: GERMANY; DocumentNumber: 5; SheetNumber: 5; SheetTotal: 5; Website: www.ultrazohm.com
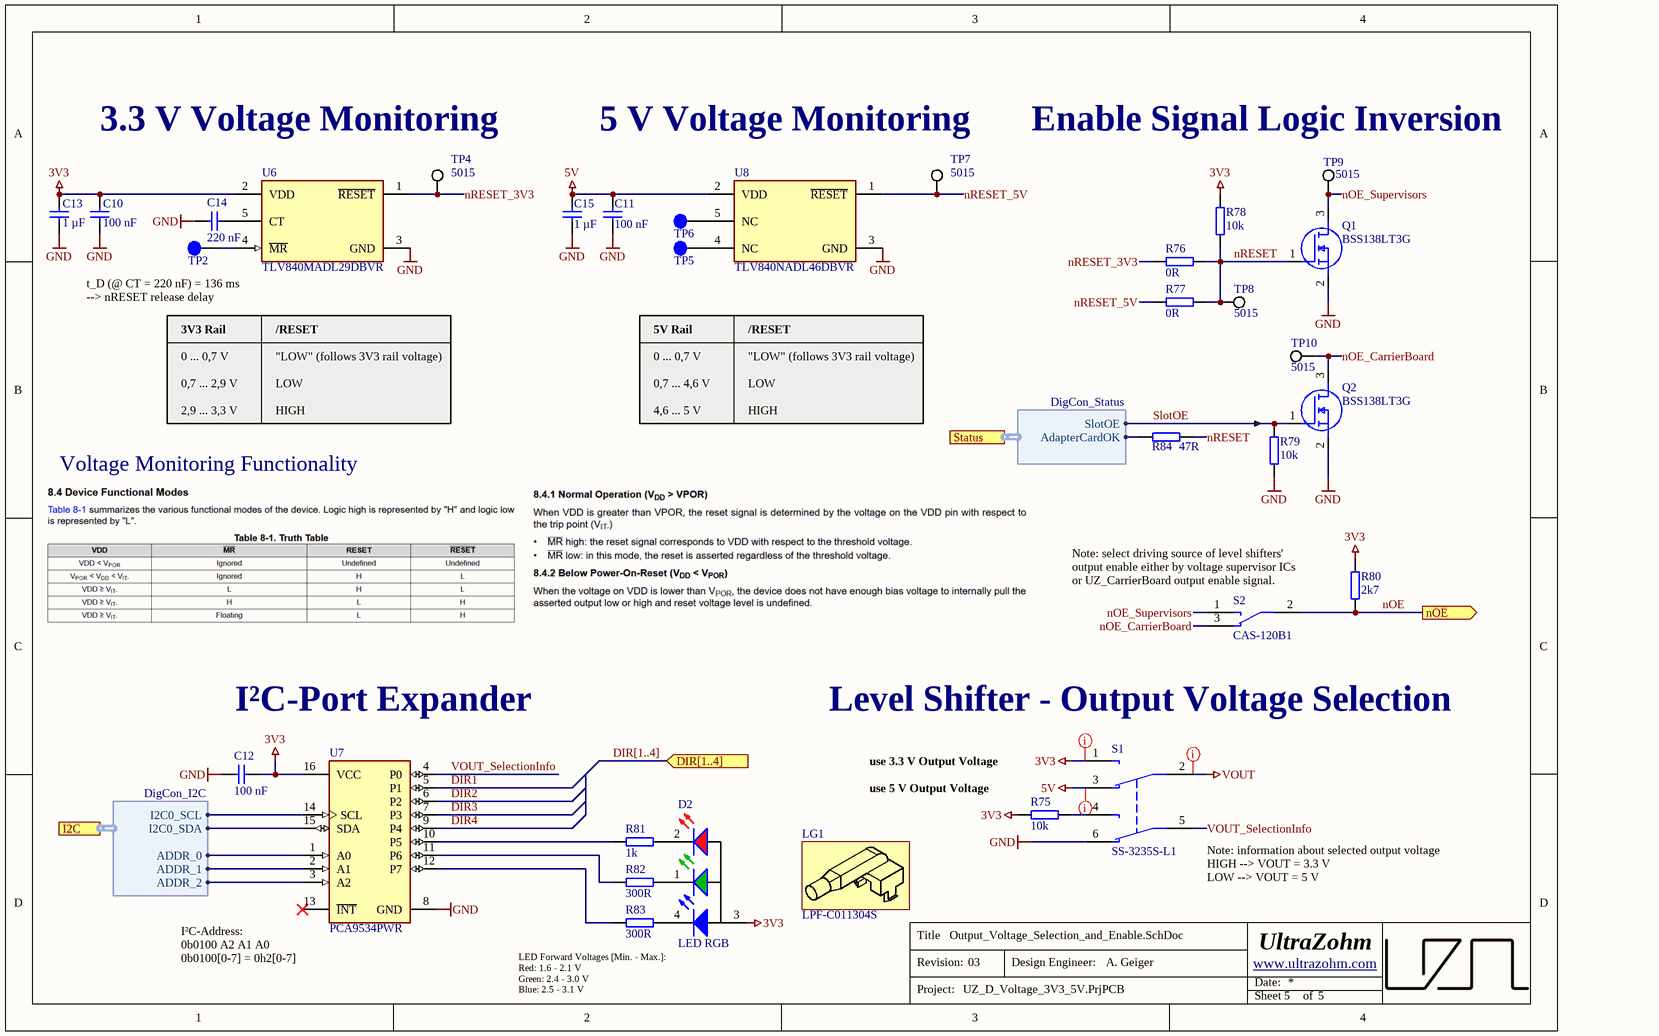
[diagram p4: Output_Voltage_Selection_and_Enable.SchDoc]

### Parts
C10  100 nF  [C_0603_TE]
C11  100 nF  [C_0603_TE]
C12  100 nF  [C_0603_TE]
C13  1 µF  [C_0603_TE]
C14  220 nF  [C_0603_TE]
C15  1 µF  [C_0603_TE]
D2  LED RGB  [LED_1615]
LG1  LPF-C011304S  [LPF-C011304S]
Q1  BSS138LT3G  [SOT-23-3]
Q2  BSS138LT3G  [SOT-23-3]
R75  10k  [R_0603_TE]
R76  0R  [R_0603_TE]
R77  0R  [R_0603_TE]
R78  10k  [R_0603_TE]
R79  10k  [R_0603_TE]
R80  2k7  [R_0603_TE]
R81  1k  [R_0603_TE]
R82  300R  [R_0603_TE]
R83  300R  [R_0603_TE]
R84  47R  [R_0603_TE]
S1  SS-3235S-L1  [SS-3235S-L1]
S2  CAS-120B1  [CAS120B1]
TP2  Testpoint 1mm  [TP_1mm]  (value not drawn)  (no BOM)
TP4  5015  [FP-5015-MFG]
TP5  Testpoint 1mm  [TP_1mm]  (value not drawn)  (no BOM)
TP6  Testpoint 1mm  [TP_1mm]  (value not drawn)  (no BOM)
TP7  5015  [FP-5015-MFG]
TP8  5015  [FP-5015-MFG]
TP9  5015  [FP-5015-MFG]
TP10  5015  [FP-5015-MFG]
U6  TLV840MADL29DBVR  [SOT23-5_DBV]
U7  PCA9534PWR  [TSSOP-16_PW0016A_N]
U8  TLV840NADL46DBVR  [SOT23-5_DBV]

### Ports
DIR[1..4] (in), I2C (harness DigCon_I2C), nOE (out), Status (harness DigCon_Status)

### Harnesses
DigCon_Status: SlotOE, AdapterCardOK
DigCon_I2C: I2C0_SDA, I2C0_SCL, ADDR_0, ADDR_1, ADDR_2

### Nets
3V3: C10.1 C12.2 C13.2 D2.3(A) R75.2 R78.2 R80.2 S1.1(NO1) U6.2(VDD) U7.16(VCC)
5V: C11.1 C15.2 S1.3(NC1) U8.2(VDD)
GND: C10.2 C11.2 C12.1 C13.1 C14.1 C15.1 Q1.2(S) Q2.2(S) R79.1 S1.6(NC2) U6.3(GND) U7.8(GND) U8.3(GND)
VOUT: S1.2(COM1)
AdapterCardOK: R84.1 ; port Status.AdapterCardOK
ADDR_0: U7.1(A0) ; port I2C.ADDR_0
ADDR_1: U7.2(A1) ; port I2C.ADDR_1
ADDR_2: U7.3(A2) ; port I2C.ADDR_2
DIR1: U7.5(P1)
DIR2: U7.6(P2)
DIR3: U7.7(P3)
DIR4: U7.9(P4)
I2C0_SCL: U7.14(SCL) ; port I2C.I2C0_SCL
I2C0_SDA: U7.15(SDA) ; port I2C.I2C0_SDA
nOE: R80.1 S2.2(COM1) ; port nOE
nOE_CarrierBoard: Q2.3(D) S2.3(NC1) TP10.1
nOE_Supervisors: Q1.3(D) S2.1(NO1) TP9.1
nRESET: Q1.1(G) R76.2 R77.2 R78.1 R84.2 TP8.1
nRESET_3V3: R76.1 TP4.1 U6.1(~{RESET})
nRESET_5V: R77.1 TP7.1 U8.1(~{RESET})
SlotOE: Q2.1(G) R79.2 ; port Status.SlotOE
VOUT_SelectionInfo: S1.5(COM2) U7.4(P0)
NetC14_2: C14.2 U6.5(CT)
NetD2_1: D2.1(K) R82.2
NetD2_2: D2.2(K) R81.1
NetD2_4: D2.4(K_B) R83.2
NetR75_1: R75.1 S1.4(NO2)
NetR81_2: R81.2 U7.10(P5)
NetR82_1: R82.1 U7.11(P6)
NetR83_1: R83.1 U7.12(P7)
NetTP2_1: TP2.1 U6.4(~{MR})
NetTP5_1: TP5.1 U8.4(NC)
NetTP6_1: TP6.1 U8.5(NC)

Not connected (* = marked no-connect by the designer): U7 13(~{INT})*

### Buses and harness runs
bus DIR[1..4] = port DIR[1..4]

### Layout directives
mark named PWR: 3V3, 5V, VOUT

### Notes on the sheet
- 3.3 V Voltage Monitoring
- 5 V Voltage Monitoring
- (near TP9) Enable Signal Logic Inversion
- t_D (@ CT = 220 nF) = 136 ms
  --> nRESET release delay
- 3V3 Rail
- 0 ... 0,7 V
- 0,7 ... 2,9 V
- /RESET
- "LOW" (follows 3V3 rail voltage)
- LOW
- 5V Rail
- 0,7 ... 4,6 V
- 2,9 ... 3,3 V
- HIGH
- 4,6 ... 5 V
- Voltage Monitoring Functionality
- (near S2) Note: select driving source of level shifters' output enable either by voltage supervisor ICs or UZ_CarrierBoard output enable signal.
- I²C-Port Expander
- Level Shifter - Output Voltage Selection
- (near R75) use 3.3 V Output Voltage
- (near R75) use 5 V Output Voltage
- (near S1) Note: information about selected output voltage
  HIGH --> VOUT = 3.3 V
  LOW --> VOUT = 5 V
- (near U7) I²C-Address:
  0b0100 A2 A1 A0
  0b0100[0-7] = 0h2[0-7]
- LED Forward Voltages [Min. - Max.]:
  Red: 1.6 - 2.1 V
  Green: 2.4 - 3.0 V
  Blue: 2.5 - 3.1 V
- Title
- Revision:
- Design Engineer:
- Date:
- Project:
- Sheet
- of

### Library data of the parts
C10 C11 = UZgen_C_0603_100nF_50V_X7R: as C2 on sheet Level_Shifter; Manufacturer Part Number: UZgen_C_0603_100nF_50V_X7R; PartID: 1; Created On: 02.07.2024 14:42:23; Value: 100 nF; Device Package: 0603; Technology: X7R; Mounting Type: SMD; Last Updated: 08.08.2024 15:01:15
C12 = UZgen_C_0603_100nF_50V_X7R: as C1 on sheet DigitalCarrierJack; Manufacturer Part Number: UZgen_C_0603_100nF_50V_X7R; PartID: 1; Created On: 02.07.2024 14:42:23; Device Package: 0603; Last Updated: 08.08.2024 15:01:15; Mounting Type: SMD; Value: 100 nF; Technology: X7R
C13 C15 = UZgen_C_0603_1uF_16V_X7R: Generic capacitor; Manufacturer: UZgen; Voltage: 16V; Tolerance: 10 %; Created from: UZgenTool; Manufacturer Part Number: UZgen_C_0603_1uF_16V_X7R; PartID: 3783; Created On: 02.08.2024 11:17:59; Value: 1 µF; Device Package: 0603; Technology: X7R; Mounting Type: SMD; Last Updated: 02.08.2024 11:17:59
C14 = UZgen_C_0603_220nF_50V_X7R: Generic capacitor; Manufacturer: UZgen; Voltage: 50V; Tolerance: 10 %; Created from: UZgenTool; Manufacturer Part Number: UZgen_C_0603_220nF_50V_X7R; PartID: 2; Created On: 02.07.2024 14:42:23; Value: 220 nF; Device Package: 0603; Technology: X7R; Mounting Type: SMD; Last Updated: 08.08.2024 15:01:15
D2 = A-SP1943B1GHR6C-C01-2T: RGB LED - SMD 1615; Manufacturer: Amicc; Type: Standard; Created from: AGeiger; Manufacturer Part Number: A-SP1943B1GHR6C-C01-2T; PartID: 31; Created On: 09.09.2024 10:45:01; ComponentLink1Description: Datasheet; ComponentLink1URL: https://www.lcsc.com/datasheet/lcsc_datasheet_2410121631_Amicc-A-SP1943B1GHR6C-C01-2T_C19171342.pdf; Component Type: LED Diode; Device Package: 1615; Last Updated: 09.09.2024 10:45:01; Mounting Type: SMD; Operating Temperature: -40 to +85 °C; Supplier 1: LCSC; Supplier Part Number 1: C19171342; Value: LED RGB; Live Cycle Status: 1; Stock number: not stored; Color: rgb; LCSC Part Number: C19171342
LG1 = LPF-C011304S: LED Light Pipes RA Light Pipe Clr 2.8mm Round; Manufacturer: Lumex; Created from: AGeiger; Manufacturer Part Number: LPF-C011304S; PartID: 54; Created On: 15.07.2024 08:35:38; ComponentLink1Description: Datasheet; ComponentLink1URL: https://www.farnell.com/datasheets/1632591.pdf; Component Type: Light Guide; Device Package: SMD; Last Updated: 22.03.2025 18:11:56; Mounting Type: SMD; Supplier 1: Mouser; Supplier Part Number 1: 696-LPF-C011304S; Type: Lightguide; Value: LPF-C011304S; Live Cycle Status: 1
Q1 Q2 = BSS138LT3G: Power MOSFET, n-Channel, 200 mA, 50 V; Manufacturer: ON Semicondutor; Value: 50 V; Created from: MGremer; Manufacturer Part Number: BSS138LT3G; PartID: 1; Created On: 02.02.2021 13:34:18; ComponentLink1Description: Datasheet; ComponentLink1URL: https://www.mouser.de/datasheet/2/308/BSS138LT1_D-1522521.pdf; Component Type: Power MOSFET; Device Package: SOT-23-3; Last Updated: 28.03.2025 21:09:28; Mounting Type: SMD; Operating Temperature: -55 - 150 °C; Series: BSS138L; Supplier 1: Mouser; Supplier Part Number 1: 863-BSS138LT3G; Type: Power MOSFET; Live Cycle Status: 1; Stock number: not stored; Supplier 2: LCSC; Supplier Part Number 2: C83790; LCSC Part Number: C83790
R75 R78 R79 = UZgen_R_0603_10k: as R42 on sheet Front_Connector; Manufacturer Part Number: UZgen_R_0603_10k; PartID: 1; Created On: 02.07.2024 14:34:53; Value: 10k; Device Package: 0603; Mounting Type: SMD; Last Updated: 02.07.2024 14:37:16
R76 R77 = UZgen_R_0603_0R: Generic resistor; Manufacturer: UZgen; Tolerance: 1 %; Created from: UZgenTool; Manufacturer Part Number: UZgen_R_0603_0R; PartID: 581; Created On: 08.07.2024 14:34:30; Value: 0R; Device Package: 0603; Mounting Type: SMD; Last Updated: 08.07.2024 14:34:30
R80 = UZgen_R_0603_2k7: Generic resistor; Manufacturer: UZgen; Tolerance: 1 %; Created from: UZgenTool; Manufacturer Part Number: UZgen_R_0603_2k7; PartID: 231; Created On: 02.07.2024 17:29:49; Value: 2k7; Device Package: 0603; Mounting Type: SMD; Last Updated: 02.07.2024 17:29:49
R81 = UZgen_R_0603_1k: as R1 on sheet DigitalCarrierJack; Manufacturer Part Number: UZgen_R_0603_1k; PartID: 221; Created On: 02.07.2024 17:29:49; Value: 1k; Device Package: 0603; Mounting Type: SMD; Last Updated: 02.07.2024 17:29:49
R82 R83 = UZgen_R_0603_300R: Generic resistor; Manufacturer: UZgen; Tolerance: 1 %; Created from: UZgenTool; Manufacturer Part Number: UZgen_R_0603_300R; PartID: 208; Created On: 02.07.2024 17:29:49; Value: 300R; Device Package: 0603; Mounting Type: SMD; Last Updated: 02.07.2024 17:29:49
R84 = UZgen_R_0603_47R: Generic resistor; Manufacturer: UZgen; Tolerance: 1 %; Created from: UZgenTool; Manufacturer Part Number: UZgen_R_0603_47R; PartID: 189; Created On: 02.07.2024 17:29:48; Value: 47R; Device Package: 0603; Mounting Type: SMD; Last Updated: 02.07.2024 17:29:48
S1 = SS-3235S-L1: 50mA Horizontal attachment DPDT 12V 12V 50mA 10,000 times Black SMD Slide Switches ROHS; Manufacturer: XKB Connection; Created from: AGeiger; Manufacturer Part Number: SS-3235S-L1; PartID: 49; Created On: 21.02.2024 17:10:55; ComponentLink1Description: Datasheet; ComponentLink1URL: https://www.lcsc.com/datasheet/lcsc_datasheet_2110111230_XKB-Connection-SS-3235S-L1_C500055.pdf; Component Type: Switch DPDT; Device Package: SMD; Last Updated: 23.08.2024 11:42:29; Mounting Type: SMD; Operating Temperature: -40 to +85 °C; Supplier 1: LCSC; Supplier Part Number 1: C500055; Type: Switch; Value: DPDT; Live Cycle Status: 1; LCSC Part Number: C500055
S2 = CAS-120B1: Slide Switches SPDT, ON-ON, slide, gull wing SMD terminals, 100mA @ 6V DC, bulk packaging, non-washable without seal tape; Manufacturer: Nidec Components; Created from: AGeiger; Manufacturer Part Number: CAS-120B1; PartID: 50; Created On: 21.02.2024 17:10:55; ComponentLink1Description: Datasheet; ComponentLink1URL: https://eu.mouser.com/datasheet/2/972/cas-1628136.pdf; Component Type: Switch SPDT; Device Package: SMD; Last Updated: 22.12.2024 16:58:00; Mounting Type: SMD; Operating Temperature: -40 to +85 °C; Supplier 1: Mouser; Supplier Part Number 1: 229-CAS-120B1; Supplier 2: LCSC; Supplier Part Number 2: C3664598; Type: DIP-Switch; Value: SPDT; Live Cycle Status: 1; LCSC Part Number: C3664598
TP2 TP5 TP6 = NULL: as TP1 on sheet DigitalCarrierJack; Created: 2018_06_25_AGeiger; Value: Testpoint 1mm; PartID: 9; Created On: 20.09.2022 13:14:57; Component Type: Testpoint; Last Updated: 20.09.2022 13:15:39; Manufacturer: NULL; Supplier 1: NULL; Supplier Part Number 1: NULL; Type: Testpoint; Live Cycle Status: 1
TP4 TP7-TP10 = 5015: as TP3 on sheet DigitalCarrierJack; ComponentLink1Description: Datasheet; ComponentLink2URL: http://www.keyelco.com/product-pdf.cfm?p=1357; ComponentLink1URL: https://www.mouser.de/datasheet/2/215/015-744075.pdf; ComponentLink2Description: Datasheet; Manufacturer Part Number: 5015; PartID: 26; Created On: 03.06.2023 11:19:55; Component Type: Circuit Board Hardware; Device Package: SMD; Last Updated: 03.06.2023 11:43:17; Mounting Type: SMD; Supplier 1: Mouser; Supplier Part Number 1: 534-5015; Type: PCB SMD Testpoint; Live Cycle Status: 1; LCSC Part Number: C5199798
U6 = TLV840MADL29DBVR: Supervisory Circuits 2.9V Monitor; Manufacturer: Texas Instruments; Value: TLV840-29; Created from: AGeiger; Manufacturer Part Number: TLV840MADL29DBVR; PartID: 56; Created On: 16.12.2024 15:31:49; ComponentLink1Description: Datasheet; ComponentLink1URL: https://www.ti.com/lit/ds/symlink/tlv840.pdf?ts=1742949911670; Component Type: Voltage Monitor; Device Package: SOT-23-5; Last Updated: 26.03.2025 08:58:10; Mounting Type: SMD; Operating Temperature: -40 to +125 °C; Supplier 1: Mouser; Supplier Part Number 1: 595-TLV840MADL29DBVR; Supplier 2: LCSC; Supplier Part Number 2: C3687807; Type: Voltage Monitor; Live Cycle Status: 1; LCSC Part Number: C3687807
U7 = PCA9534PWR: 8-bit 2.3- to 5.5-V I2C/SMBus I/O expander with interrupt & config registers; Manufacturer: Texas Instruments; Created from: AGeiger; Manufacturer Part Number: PCA9534PWR; PartID: 6; Created On: 18.06.2024 19:29:27; ComponentLink1Description: Datasheet; ComponentLink1URL: https://www.ti.com/lit/gpn/pca9534; Component Type: I2C-IO-Expander; Device Package: TSSOP-16; Last Updated: 18.07.2024 09:13:25; Mounting Type: SMD; Supplier 1: Mouser; Supplier Part Number 1: 771-PCAL9539APW118; Supplier 2: LCSC; Supplier Part Number 2: 595-PCA9534PWR; Type: I2C IO Expander; Live Cycle Status: 1; LCSC Part Number: C133803; Stock number: not stored
U8 = TLV840NADL46DBVR: Supervisory Circuits 4.6V Monitor; Manufacturer: Texas Instruments; Value: TLV840-46; Created from: AGeiger; Manufacturer Part Number: TLV840NADL46DBVR; PartID: 57; Created On: 16.12.2024 15:31:49; ComponentLink1Description: Datasheet; ComponentLink1URL: https://www.ti.com/lit/ds/symlink/tlv840.pdf?ts=1742949911670; Component Type: Voltage Monitor; Device Package: SOT-23-5; Last Updated: 26.03.2025 08:58:10; Mounting Type: SMD; Operating Temperature: -40 to +125 °C; Supplier 1: Mouser; Supplier Part Number 1: 595-TLV840NADL46DBVR; Supplier 2: LCSC; Supplier Part Number 2: C2870132; Type: Voltage Monitor; Live Cycle Status: 1; LCSC Part Number: C2870132

## Nets that join several sheets
3V3: DigitalCarrierJack (11 pins), Front_Connector (X3.10), Level_Shifter (12 pins), Output_Voltage_Selection_and_Enable (10 pins)
5V: DigitalCarrierJack (F2.2 TP3.1), Front_Connector (X3.20), Output_Voltage_Selection_and_Enable (C11.1 C15.2 S1.3 U8.2)
GND: DigitalCarrierJack (51 pins), Front_Connector (65 pins), Level_Shifter (58 pins), Output_Voltage_Selection_and_Enable (13 pins)
VIN: DigitalCarrierJack (F1.2 R8.2), Front_Connector (X2.1 X3.1)
VOUT: Level_Shifter (12 pins), Output_Voltage_Selection_and_Enable (S1.2)
AdapterCardOK: DigitalCarrierJack (R1.2 X1.100), Output_Voltage_Selection_and_Enable (R84.1)
ADDR_0: DigitalCarrierJack (R5.2 U1.1 X1.79), Output_Voltage_Selection_and_Enable (U7.1)
ADDR_1: DigitalCarrierJack (R4.2 U1.2 X1.95), Output_Voltage_Selection_and_Enable (U7.2)
ADDR_2: DigitalCarrierJack (R3.2 U1.3 X1.80), Output_Voltage_Selection_and_Enable (U7.3)
DIG_IO_00: DigitalCarrierJack (X1.17), Level_Shifter (R43.1 U2.3)
DIG_IO_01: DigitalCarrierJack (X1.18), Level_Shifter (R44.1 U2.4)
DIG_IO_02: DigitalCarrierJack (X1.21), Level_Shifter (R45.1 U2.5)
DIG_IO_03: DigitalCarrierJack (X1.22), Level_Shifter (R46.1 U2.6)
DIG_IO_04: DigitalCarrierJack (X1.25), Level_Shifter (R47.1 U2.7)
DIG_IO_05: DigitalCarrierJack (X1.26), Level_Shifter (R48.1 U2.8)
DIG_IO_06: DigitalCarrierJack (X1.29), Level_Shifter (R49.1 U2.9)
DIG_IO_07: DigitalCarrierJack (X1.30), Level_Shifter (R50.1 U2.10)
DIG_IO_08: DigitalCarrierJack (X1.33), Level_Shifter (R51.1 U4.3)
DIG_IO_09: DigitalCarrierJack (X1.34), Level_Shifter (R52.1 U4.4)
DIG_IO_10: DigitalCarrierJack (X1.37), Level_Shifter (R53.1 U4.5)
DIG_IO_11: DigitalCarrierJack (X1.38), Level_Shifter (R54.1 U4.6)
DIG_IO_12: DigitalCarrierJack (X1.41), Level_Shifter (R55.1 U4.7)
DIG_IO_13: DigitalCarrierJack (X1.42), Level_Shifter (R56.1 U4.8)
DIG_IO_14: DigitalCarrierJack (X1.45), Level_Shifter (R57.1 U4.9)
DIG_IO_15: DigitalCarrierJack (X1.46), Level_Shifter (R58.1 U4.10)
DIG_IO_16: DigitalCarrierJack (X1.49), Level_Shifter (R59.1 U3.3)
DIG_IO_17: DigitalCarrierJack (X1.50), Level_Shifter (R60.1 U3.4)
DIG_IO_18: DigitalCarrierJack (X1.53), Level_Shifter (R61.1 U3.5)
DIG_IO_19: DigitalCarrierJack (X1.54), Level_Shifter (R62.1 U3.6)
DIG_IO_20: DigitalCarrierJack (X1.57), Level_Shifter (R63.1 U3.7)
DIG_IO_21: DigitalCarrierJack (X1.58), Level_Shifter (R64.1 U3.8)
DIG_IO_22: DigitalCarrierJack (X1.61), Level_Shifter (R65.1 U3.9)
DIG_IO_23: DigitalCarrierJack (X1.62), Level_Shifter (R66.1 U3.10)
DIG_IO_24: DigitalCarrierJack (X1.65), Level_Shifter (R67.1 U5.3)
DIG_IO_25: DigitalCarrierJack (X1.66), Level_Shifter (R68.1 U5.4)
DIG_IO_26: DigitalCarrierJack (X1.69), Level_Shifter (R69.1 U5.5)
DIG_IO_27: DigitalCarrierJack (X1.70), Level_Shifter (R70.1 U5.6)
DIG_IO_28: DigitalCarrierJack (X1.73), Level_Shifter (R71.1 U5.7)
DIG_IO_29: DigitalCarrierJack (X1.74), Level_Shifter (R72.1 U5.8)
DIG_IO_EXT_00: Front_Connector (R9.1 R42.1), Level_Shifter (U2.21)
DIG_IO_EXT_01: Front_Connector (R10.1 R73.1), Level_Shifter (U2.20)
DIG_IO_EXT_02: Front_Connector (R11.1 R74.1), Level_Shifter (U2.19)
DIG_IO_EXT_03: Front_Connector (R12.1 R85.1), Level_Shifter (U2.18)
DIG_IO_EXT_04: Front_Connector (R13.1 R86.1), Level_Shifter (U2.17)
DIG_IO_EXT_05: Front_Connector (R14.1 R87.1), Level_Shifter (U2.16)
DIG_IO_EXT_06: Front_Connector (R15.1 R88.1), Level_Shifter (U2.15)
DIG_IO_EXT_07: Front_Connector (R16.1 R89.1), Level_Shifter (U2.14)
DIG_IO_EXT_08: Front_Connector (R17.1 R90.1), Level_Shifter (U4.21)
DIG_IO_EXT_09: Front_Connector (R18.1 R91.1), Level_Shifter (U4.20)
DIG_IO_EXT_10: Front_Connector (R19.1 R92.1), Level_Shifter (U4.19)
DIG_IO_EXT_11: Front_Connector (R20.1 R93.1), Level_Shifter (U4.18)
DIG_IO_EXT_12: Front_Connector (R21.1 R94.1), Level_Shifter (U4.17)
DIG_IO_EXT_13: Front_Connector (R22.1 R95.1), Level_Shifter (U4.16)
DIG_IO_EXT_14: Front_Connector (R23.1 R96.1), Level_Shifter (U4.15)
DIG_IO_EXT_15: Front_Connector (R24.1 R97.1), Level_Shifter (U4.14)
DIG_IO_EXT_16: Front_Connector (R25.1 R98.1), Level_Shifter (U3.21)
DIG_IO_EXT_17: Front_Connector (R26.1 R99.1), Level_Shifter (U3.20)
DIG_IO_EXT_18: Front_Connector (R27.1 R100.1), Level_Shifter (U3.19)
DIG_IO_EXT_19: Front_Connector (R28.1 R101.1), Level_Shifter (U3.18)
DIG_IO_EXT_20: Front_Connector (R29.1 R102.1), Level_Shifter (U3.17)
DIG_IO_EXT_21: Front_Connector (R30.1 R103.1), Level_Shifter (U3.16)
DIG_IO_EXT_22: Front_Connector (R31.1 R104.1), Level_Shifter (U3.15)
DIG_IO_EXT_23: Front_Connector (R32.1 R105.1), Level_Shifter (U3.14)
DIG_IO_EXT_24: Front_Connector (R33.1 R106.1), Level_Shifter (U5.21)
DIG_IO_EXT_25: Front_Connector (R34.1 R107.1), Level_Shifter (U5.20)
DIG_IO_EXT_26: Front_Connector (R35.1 R108.1), Level_Shifter (U5.19)
DIG_IO_EXT_27: Front_Connector (R36.1 R109.1), Level_Shifter (U5.18)
DIG_IO_EXT_28: Front_Connector (R37.1 R110.1), Level_Shifter (U5.17)
DIG_IO_EXT_29: Front_Connector (R38.1 R111.1), Level_Shifter (U5.16)
DIR1: Level_Shifter (R2.1 SW1.8 U2.2), Output_Voltage_Selection_and_Enable (U7.5)
DIR2: Level_Shifter (R39.1 SW1.7 U4.2), Output_Voltage_Selection_and_Enable (U7.6)
DIR3: Level_Shifter (R40.1 SW1.6 U3.2), Output_Voltage_Selection_and_Enable (U7.7)
DIR4: Level_Shifter (R41.1 SW1.5 U5.2), Output_Voltage_Selection_and_Enable (U7.9)
I2C0_SCL: DigitalCarrierJack (R7.2 U1.6 X1.89), Output_Voltage_Selection_and_Enable (U7.14)
I2C0_SDA: DigitalCarrierJack (R6.2 U1.5 X1.90), Output_Voltage_Selection_and_Enable (U7.15)
nOE: Level_Shifter (U2.22 U3.22 U4.22 U5.22), Output_Voltage_Selection_and_Enable (R80.1 S2.2)
SlotOE: DigitalCarrierJack (TP1.1 X1.99), Output_Voltage_Selection_and_Enable (Q2.1 R79.2)